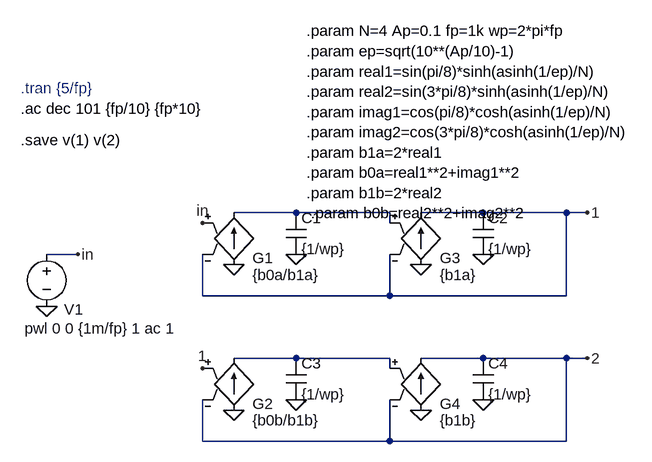
[diagram p0: schematic 4th_cheb.asc]
4th_cheb.asc, the LTspice schematic file:
Version 4
SHEET 1 3596 1400
WIRE 208 144 112 144
WIRE 352 144 208 144
WIRE 496 144 400 144
WIRE 624 144 496 144
WIRE 656 144 624 144
WIRE 352 160 352 144
WIRE -128 208 -176 208
WIRE 64 272 64 208
WIRE 352 272 352 208
WIRE 352 272 64 272
WIRE 624 272 624 144
WIRE 624 272 352 272
WIRE 208 368 112 368
WIRE 352 368 208 368
WIRE 496 368 400 368
WIRE 624 368 496 368
WIRE 656 368 624 368
WIRE 352 384 352 368
WIRE 64 496 64 432
WIRE 352 496 352 432
WIRE 352 496 64 496
WIRE 624 496 624 368
WIRE 624 496 352 496
FLAG 208 208 0
FLAG 112 224 0
FLAG -176 288 0
FLAG -128 208 in
FLAG 656 144 1
FLAG 496 208 0
FLAG 400 224 0
FLAG 64 160 in
FLAG 208 432 0
FLAG 112 448 0
FLAG 656 368 2
FLAG 496 432 0
FLAG 400 448 0
FLAG 64 384 1
SYMBOL g 112 128 R0
WINDOW 0 29 86 Left 2
WINDOW 3 29 112 Left 2
SYMATTR InstName G1
SYMATTR Value {b0a/b1a}
SYMBOL cap 192 144 R0
SYMATTR Value2 Rpar=1g
SYMATTR InstName C1
SYMATTR Value {1/wp}
SYMBOL voltage -176 192 R0
WINDOW 0 27 101 Left 2
WINDOW 3 -34 130 Left 2
SYMATTR InstName V1
SYMATTR Value pwl 0 0 {1m/fp} 1 ac 1
SYMBOL g 400 128 R0
WINDOW 0 29 86 Left 2
WINDOW 3 29 112 Left 2
SYMATTR InstName G3
SYMATTR Value {b1a}
SYMBOL cap 480 144 R0
SYMATTR Value2 Rpar=1g
SYMATTR InstName C2
SYMATTR Value {1/wp}
SYMBOL g 112 352 R0
WINDOW 0 29 86 Left 2
WINDOW 3 29 112 Left 2
SYMATTR InstName G2
SYMATTR Value {b0b/b1b}
SYMBOL cap 192 368 R0
SYMATTR Value2 Rpar=1g
SYMATTR InstName C3
SYMATTR Value {1/wp}
SYMBOL g 400 352 R0
WINDOW 0 29 86 Left 2
WINDOW 3 29 112 Left 2
SYMATTR InstName G4
SYMATTR Value {b1b}
SYMBOL cap 480 368 R0
SYMATTR Value2 Rpar=1g
SYMATTR InstName C4
SYMATTR Value {1/wp}
TEXT 224 -136 Left 2 !.param N=4 Ap=0.1 fp=1k wp=2*pi*fp\n.param ep=sqrt(10**(Ap/10)-1)\n.param real1=sin(pi/8)*sinh(asinh(1/ep)/N)\n.param real2=sin(3*pi/8)*sinh(asinh(1/ep)/N)\n.param imag1=cos(pi/8)*cosh(asinh(1/ep)/N)\n.param imag2=cos(3*pi/8)*cosh(asinh(1/ep)/N)\n.param b1a=2*real1\n.param b0a=real1**2+imag1**2\n.param b1b=2*real2\n .param b0b=real2**2+imag2**2
TEXT -216 -16 Left 2 !.ac dec 101 {fp/10} {fp*10}
TEXT -216 -48 Left 2 ;.tran {5/fp}
TEXT -216 32 Left 2 !.save v(1) v(2)

The netlist it stands for:
* 4th_cheb.asc
G1 0 N001 in 1 {b0a/b1a}
C1 N001 0 {1/wp} Rpar=1g
V1 in 0 pwl 0 0 {1m/fp} 1 ac 1
G3 0 1 N001 1 {b1a}
C2 1 0 {1/wp} Rpar=1g
G2 0 N002 1 2 {b0b/b1b}
C3 N002 0 {1/wp} Rpar=1g
G4 0 2 N002 2 {b1b}
C4 2 0 {1/wp} Rpar=1g
.param N=4 Ap=0.1 fp=1k wp=2*pi*fp
.param ep=sqrt(10**(Ap/10)-1)
.param real1=sin(pi/8)*sinh(asinh(1/ep)/N)
.param real2=sin(3*pi/8)*sinh(asinh(1/ep)/N)
.param imag1=cos(pi/8)*cosh(asinh(1/ep)/N)
.param imag2=cos(3*pi/8)*cosh(asinh(1/ep)/N)
.param b1a=2*real1
.param b0a=real1**2+imag1**2
.param b1b=2*real2
 .param b0b=real2**2+imag2**2
.ac dec 101 {fp/10} {fp*10}
* .tran {5/fp}
.save v(1) v(2)
.backanno
.end